# EAGLE schematic sd_card (EAGLE 6.0)
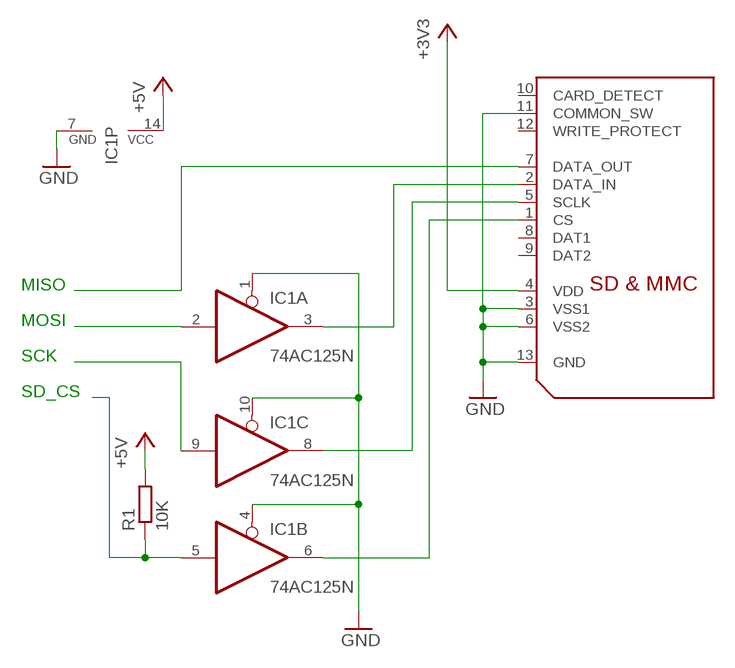
[diagram p0: schematic, sheet 1]

## Parts
IC1  74AC125N  [DIL14]
R1  10K  R-EU_0207/10  [0207/10]
U$1  SDMMCSCDA  [SCDA]

## Nets
+3V3: U$1.4(VDD)
+5V: IC1.14(P:VCC) R1.2
GND: IC1.7(P:GND) U$1.3(VSS1) U$1.6(VSS2) U$1.11(COMMON_SW) U$1.13(GND)
N$2: IC1.1(A:OE) IC1.4(B:OE) IC1.10(C:OE) ; supply symbol labelled GND
N$7: IC1.3(A:O) U$1.2(DATA_IN)
N$8: IC1.8(C:O) U$1.5(SCLK)
N$9: IC1.6(B:O) U$1.1(CS)
N$10: U$1.7(DATA_OUT)
N$11: IC1.9(C:I)
N$12: IC1.2(A:I)
N$13: IC1.5(B:I) R1.1
Unconnected: IC1.11(D:O) IC1.12(D:I) IC1.13(D:OE) U$1.8(DAT1) U$1.9(DAT2) U$1.10(CARD_DETECT) U$1.12(WRITE_PROTECT)

## Notes on the sheet
- MISO
- MOSI
- SCK
- SD_CS

## Library data of the parts
IC1 = 74xx-eu:74*125: Quad bus BUFFER, 3-state
R1 = rcl:R-EU_: RESISTOR, European symbol
U$1 = adafruit:SDMMC: SD MMC Card holder 4UCON part #06132 - easy to solder